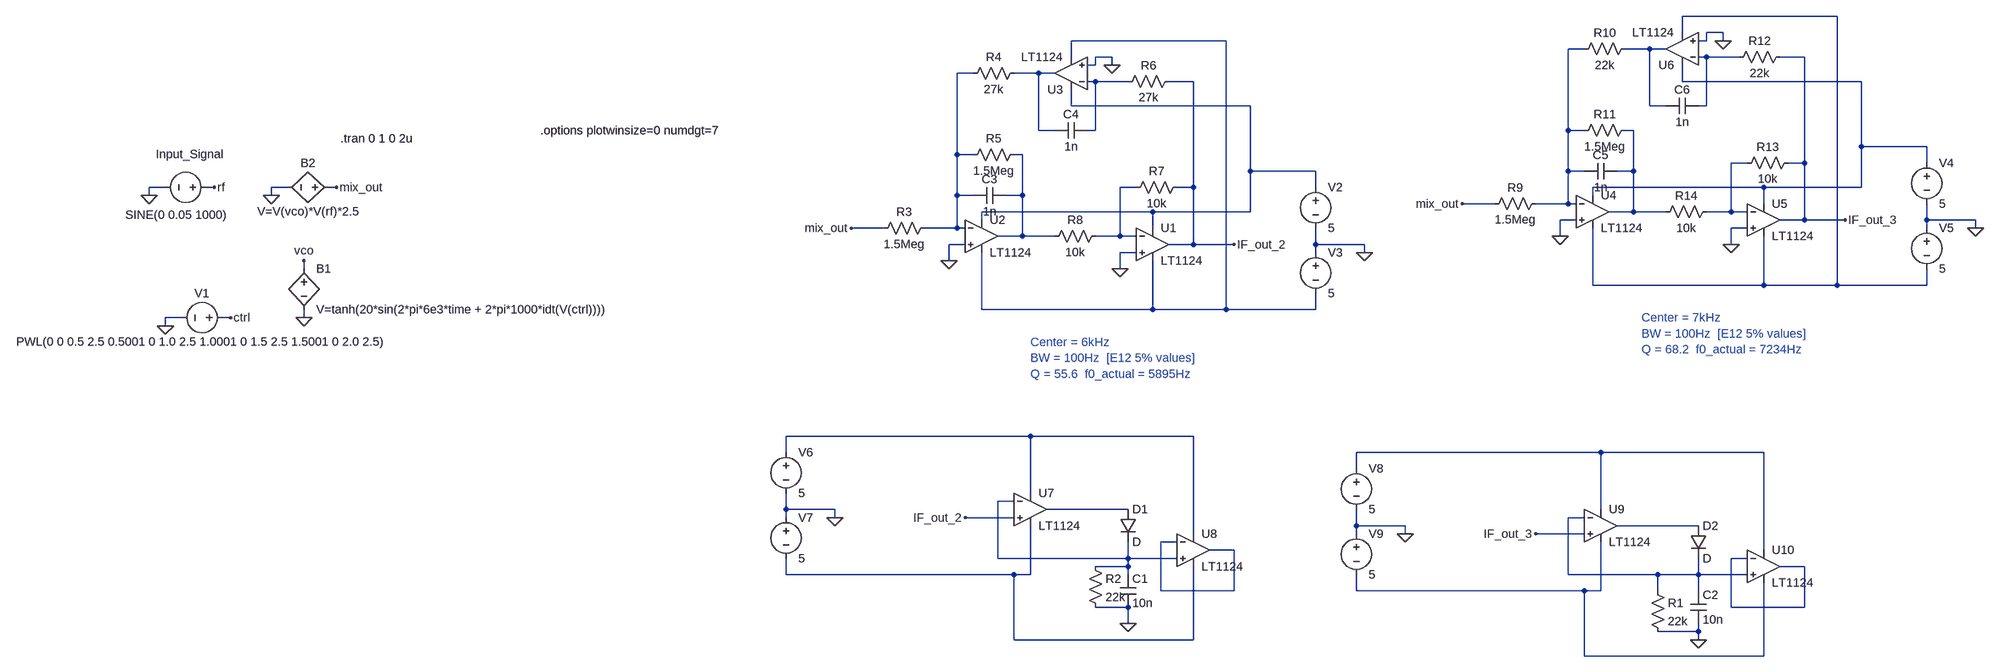
[diagram p0: schematic 5filter_square_pulse.asc]
5filter_square_pulse.asc, the LTspice schematic file:
Version 4.1
SHEET 1 4280 1204
WIRE 3632 -160 3328 -160
WIRE 3328 -128 3328 -160
WIRE 3408 -128 3376 -128
WIRE 2432 -112 2128 -112
WIRE 3376 -112 3376 -128
WIRE 3376 -112 3360 -112
WIRE 3408 -112 3408 -128
WIRE 3136 -96 3104 -96
WIRE 3264 -96 3216 -96
WIRE 3296 -96 3264 -96
WIRE 2128 -80 2128 -112
WIRE 2208 -80 2176 -80
WIRE 3376 -80 3360 -80
WIRE 3440 -80 3376 -80
WIRE 3568 -80 3520 -80
WIRE 2176 -64 2176 -80
WIRE 2176 -64 2160 -64
WIRE 2208 -64 2208 -80
WIRE 1936 -48 1904 -48
WIRE 2064 -48 2016 -48
WIRE 2096 -48 2064 -48
WIRE 2176 -32 2160 -32
WIRE 2240 -32 2176 -32
WIRE 2368 -32 2320 -32
WIRE 3328 -32 3328 -64
WIRE 3680 -32 3328 -32
WIRE 2128 16 2128 -16
WIRE 2480 16 2128 16
WIRE 3264 16 3264 -96
WIRE 3296 16 3264 16
WIRE 3376 16 3376 -80
WIRE 3376 16 3360 16
WIRE 2064 64 2064 -48
WIRE 2096 64 2064 64
WIRE 2176 64 2176 -32
WIRE 2176 64 2160 64
WIRE 3104 64 3104 -96
WIRE 3136 64 3104 64
WIRE 3232 64 3216 64
WIRE 3680 96 3680 -32
WIRE 3808 96 3680 96
WIRE 1904 112 1904 -48
WIRE 1936 112 1904 112
WIRE 2032 112 2016 112
WIRE 3456 128 3424 128
WIRE 3568 128 3568 -80
WIRE 3568 128 3536 128
WIRE 3808 128 3808 96
WIRE 2480 144 2480 16
WIRE 2608 144 2480 144
WIRE 3104 144 3104 64
WIRE 3136 144 3104 144
WIRE 3232 144 3232 64
WIRE 3232 144 3200 144
WIRE 16 176 -16 176
WIRE 112 176 96 176
WIRE 256 176 224 176
WIRE 352 176 336 176
WIRE 2256 176 2224 176
WIRE 2368 176 2368 -32
WIRE 2368 176 2336 176
WIRE 2608 176 2608 144
WIRE 3488 176 3152 176
WIRE 3680 176 3680 96
WIRE 3680 176 3488 176
WIRE -16 192 -16 176
WIRE 224 192 224 176
WIRE 1904 192 1904 112
WIRE 1936 192 1904 192
WIRE 2032 192 2032 112
WIRE 2032 192 2000 192
WIRE 3152 192 3152 176
WIRE 2960 208 2896 208
WIRE 3104 208 3104 144
WIRE 3104 208 3040 208
WIRE 3120 208 3104 208
WIRE 3488 208 3488 176
WIRE 2288 224 1952 224
WIRE 2480 224 2480 144
WIRE 2480 224 2288 224
WIRE 3232 224 3232 144
WIRE 3232 224 3184 224
WIRE 3296 224 3232 224
WIRE 3424 224 3424 128
WIRE 3424 224 3376 224
WIRE 3456 224 3424 224
WIRE 1952 240 1952 224
WIRE 3120 240 3088 240
WIRE 3568 240 3568 128
WIRE 3568 240 3520 240
WIRE 3648 240 3568 240
WIRE 3808 240 3808 208
WIRE 3904 240 3808 240
WIRE 1760 256 1696 256
WIRE 1904 256 1904 192
WIRE 1904 256 1840 256
WIRE 1920 256 1904 256
WIRE 2288 256 2288 224
WIRE 3456 256 3424 256
WIRE 3808 256 3808 240
WIRE 3904 256 3904 240
WIRE 2032 272 2032 192
WIRE 2032 272 1984 272
WIRE 2096 272 2032 272
WIRE 2224 272 2224 176
WIRE 2224 272 2176 272
WIRE 2256 272 2224 272
WIRE 3088 272 3088 240
WIRE 1920 288 1888 288
WIRE 2368 288 2368 176
WIRE 2368 288 2320 288
WIRE 2448 288 2368 288
WIRE 2608 288 2608 256
WIRE 2704 288 2608 288
WIRE 3424 288 3424 256
WIRE 2256 304 2224 304
WIRE 2608 304 2608 288
WIRE 2704 304 2704 288
WIRE 1888 320 1888 288
WIRE 288 336 288 320
WIRE 2224 336 2224 304
WIRE 3152 368 3152 256
WIRE 3488 368 3488 272
WIRE 3488 368 3152 368
WIRE 3632 368 3632 -160
WIRE 3632 368 3488 368
WIRE 3808 368 3808 336
WIRE 3808 368 3632 368
WIRE 1952 416 1952 304
WIRE 2288 416 2288 320
WIRE 2288 416 1952 416
WIRE 2432 416 2432 -112
WIRE 2432 416 2288 416
WIRE 2608 416 2608 384
WIRE 2608 416 2432 416
WIRE 48 432 16 432
WIRE 144 432 128 432
WIRE 288 432 288 416
WIRE 16 448 16 432
WIRE 2048 768 1568 768
WIRE 2368 768 2048 768
WIRE 1568 800 1568 768
WIRE 3168 800 2688 800
WIRE 3488 800 3168 800
WIRE 2688 832 2688 800
WIRE 2048 880 2048 768
WIRE 2016 896 1984 896
WIRE 1568 912 1568 880
WIRE 1664 912 1568 912
WIRE 2240 912 2080 912
WIRE 3168 912 3168 800
WIRE 1568 928 1568 912
WIRE 1664 928 1664 912
WIRE 2016 928 1920 928
WIRE 3136 928 3104 928
WIRE 2688 944 2688 912
WIRE 2784 944 2688 944
WIRE 3360 944 3200 944
WIRE 2368 960 2368 768
WIRE 2688 960 2688 944
WIRE 2784 960 2784 944
WIRE 3136 960 3040 960
WIRE 2336 976 2304 976
WIRE 2448 992 2400 992
WIRE 3488 992 3488 800
WIRE 1984 1008 1984 896
WIRE 2240 1008 2240 976
WIRE 2240 1008 1984 1008
WIRE 2336 1008 2240 1008
WIRE 3456 1008 3424 1008
WIRE 2240 1024 2240 1008
WIRE 2240 1024 2176 1024
WIRE 3568 1024 3520 1024
WIRE 1568 1040 1568 1008
WIRE 2016 1040 1568 1040
WIRE 2048 1040 2048 944
WIRE 2048 1040 2016 1040
WIRE 2240 1040 2240 1024
WIRE 3104 1040 3104 928
WIRE 3280 1040 3104 1040
WIRE 3360 1040 3360 1008
WIRE 3360 1040 3280 1040
WIRE 3456 1040 3360 1040
WIRE 2304 1072 2304 976
WIRE 2448 1072 2448 992
WIRE 2448 1072 2304 1072
WIRE 2688 1072 2688 1040
WIRE 3136 1072 2688 1072
WIRE 3168 1072 3168 976
WIRE 3168 1072 3136 1072
WIRE 3280 1072 3280 1040
WIRE 3360 1072 3360 1040
WIRE 2240 1104 2176 1104
WIRE 3424 1104 3424 1008
WIRE 3568 1104 3568 1024
WIRE 3568 1104 3424 1104
WIRE 2240 1136 2240 1104
WIRE 3360 1152 3360 1136
WIRE 3360 1152 3280 1152
WIRE 2016 1168 2016 1040
WIRE 2368 1168 2368 1024
WIRE 2368 1168 2016 1168
WIRE 3360 1168 3360 1152
WIRE 3136 1200 3136 1072
WIRE 3488 1200 3488 1056
WIRE 3488 1200 3136 1200
FLAG 144 432 ctrl
FLAG 288 320 vco
FLAG 112 176 rf
FLAG 352 176 mix_out
FLAG 16 448 0
FLAG -16 192 0
FLAG 224 192 0
FLAG 288 432 0
FLAG 2208 -64 0
FLAG 2224 336 0
FLAG 1888 320 0
FLAG 2704 304 0
FLAG 1696 256 mix_out
FLAG 2448 288 IF_out_2
FLAG 3408 -112 0
FLAG 3424 288 0
FLAG 3088 272 0
FLAG 3904 256 0
FLAG 2896 208 mix_out
FLAG 3648 240 IF_out_3
FLAG 1664 928 0
FLAG 2240 1136 0
FLAG 1920 928 IF_out_2
FLAG 2784 960 0
FLAG 3360 1168 0
FLAG 3040 960 IF_out_3
SYMBOL voltage 112 176 R90
WINDOW 123 0 0 Left 0
WINDOW 39 0 0 Left 0
WINDOW 0 -65 -20 VRight 2
WINDOW 3 54 -26 VRight 2
SYMATTR InstName Input_Signal
SYMATTR Value SINE(0 0.05 1000)
SYMBOL bv 288 320 R0
SYMATTR InstName B1
SYMATTR Value V=tanh(20*sin(2*pi*6e3*time + 2*pi*1000*idt(V(ctrl))))
SYMBOL voltage 144 432 R90
WINDOW 0 -32 56 VBottom 2
WINDOW 3 32 56 VTop 2
WINDOW 123 0 0 Left 0
WINDOW 39 0 0 Left 0
SYMATTR InstName V1
SYMATTR Value PWL(0 0 0.5 2.5 0.5001 0 1.0 2.5 1.0001 0 1.5 2.5 1.5001 0 2.0 2.5)
SYMBOL bv 352 176 R90
WINDOW 0 -32 56 VBottom 2
WINDOW 3 32 56 VTop 2
SYMATTR InstName B2
SYMATTR Value V=V(vco)*V(rf)*2.5
SYMBOL OpAmps\\LT1124 1952 208 R0
SYMATTR InstName U2
SYMBOL OpAmps\\LT1124 2288 224 R0
SYMATTR InstName U1
SYMBOL OpAmps\\LT1124 2128 16 R180
SYMATTR InstName U3
SYMBOL res 1856 240 R90
WINDOW 0 0 56 VBottom 2
WINDOW 3 32 56 VTop 2
SYMATTR InstName R3
SYMATTR Value 1.5Meg
SYMATTR SpiceLine tol=1
SYMBOL res 2032 -64 R90
WINDOW 0 0 56 VBottom 2
WINDOW 3 32 56 VTop 2
SYMATTR InstName R4
SYMATTR Value 27k
SYMATTR SpiceLine tol=1
SYMBOL res 2032 96 R90
WINDOW 0 0 56 VBottom 2
WINDOW 3 32 56 VTop 2
SYMATTR InstName R5
SYMATTR Value 1.5Meg
SYMATTR SpiceLine tol=1
SYMBOL res 2336 -48 R90
WINDOW 0 0 56 VBottom 2
WINDOW 3 32 56 VTop 2
SYMATTR InstName R6
SYMATTR Value 27k
SYMATTR SpiceLine tol=1
SYMBOL res 2352 160 R90
WINDOW 0 0 56 VBottom 2
WINDOW 3 32 56 VTop 2
SYMATTR InstName R7
SYMATTR Value 10k
SYMATTR SpiceLine tol=1
SYMBOL res 2192 256 R90
WINDOW 0 0 56 VBottom 2
WINDOW 3 32 56 VTop 2
SYMATTR InstName R8
SYMATTR Value 10k
SYMATTR SpiceLine tol=1
SYMBOL cap 2000 176 R90
WINDOW 0 0 32 VBottom 2
WINDOW 3 32 32 VTop 2
SYMATTR InstName C3
SYMATTR Value 1n
SYMBOL cap 2160 48 R90
WINDOW 0 0 32 VBottom 2
WINDOW 3 32 32 VTop 2
SYMATTR InstName C4
SYMATTR Value 1n
SYMBOL voltage 2608 160 R0
WINDOW 123 0 0 Left 0
WINDOW 39 0 0 Left 0
SYMATTR InstName V2
SYMATTR Value 5
SYMBOL voltage 2608 288 R0
WINDOW 123 0 0 Left 0
WINDOW 39 0 0 Left 0
SYMATTR InstName V3
SYMATTR Value 5
SYMBOL OpAmps\\LT1124 3152 160 R0
SYMATTR InstName U4
SYMBOL OpAmps\\LT1124 3488 176 R0
SYMATTR InstName U5
SYMBOL OpAmps\\LT1124 3328 -32 R180
SYMATTR InstName U6
SYMBOL res 3056 192 R90
WINDOW 0 0 56 VBottom 2
WINDOW 3 32 56 VTop 2
SYMATTR InstName R9
SYMATTR Value 1.5Meg
SYMATTR SpiceLine tol=1
SYMBOL res 3232 -112 R90
WINDOW 0 0 56 VBottom 2
WINDOW 3 32 56 VTop 2
SYMATTR InstName R10
SYMATTR Value 22k
SYMATTR SpiceLine tol=1
SYMBOL res 3232 48 R90
WINDOW 0 0 56 VBottom 2
WINDOW 3 32 56 VTop 2
SYMATTR InstName R11
SYMATTR Value 1.5Meg
SYMATTR SpiceLine tol=1
SYMBOL res 3536 -96 R90
WINDOW 0 0 56 VBottom 2
WINDOW 3 32 56 VTop 2
SYMATTR InstName R12
SYMATTR Value 22k
SYMATTR SpiceLine tol=0.1
SYMBOL res 3552 112 R90
WINDOW 0 0 56 VBottom 2
WINDOW 3 32 56 VTop 2
SYMATTR InstName R13
SYMATTR Value 10k
SYMATTR SpiceLine tol=1
SYMBOL res 3392 208 R90
WINDOW 0 0 56 VBottom 2
WINDOW 3 32 56 VTop 2
SYMATTR InstName R14
SYMATTR Value 10k
SYMATTR SpiceLine tol=1
SYMBOL cap 3200 128 R90
WINDOW 0 0 32 VBottom 2
WINDOW 3 32 32 VTop 2
SYMATTR InstName C5
SYMATTR Value 1n
SYMBOL cap 3360 0 R90
WINDOW 0 0 32 VBottom 2
WINDOW 3 32 32 VTop 2
SYMATTR InstName C6
SYMATTR Value 1n
SYMBOL voltage 3808 112 R0
WINDOW 123 0 0 Left 0
WINDOW 39 0 0 Left 0
SYMATTR InstName V4
SYMATTR Value 5
SYMBOL voltage 3808 240 R0
WINDOW 123 0 0 Left 0
WINDOW 39 0 0 Left 0
SYMATTR InstName V5
SYMATTR Value 5
SYMBOL OpAmps\\LT1124 2048 848 R0
SYMATTR InstName U7
SYMBOL voltage 1568 784 R0
WINDOW 123 0 0 Left 0
WINDOW 39 0 0 Left 0
SYMATTR InstName V6
SYMATTR Value 5
SYMBOL voltage 1568 912 R0
WINDOW 123 0 0 Left 0
WINDOW 39 0 0 Left 0
SYMATTR InstName V7
SYMATTR Value 5
SYMBOL diode 2224 912 R0
SYMATTR InstName D1
SYMBOL cap 2224 1040 R0
SYMATTR InstName C1
SYMATTR Value 10n
SYMBOL OpAmps\\LT1124 2368 928 R0
SYMATTR InstName U8
SYMBOL OpAmps\\LT1124 3168 880 R0
SYMATTR InstName U9
SYMBOL voltage 2688 816 R0
WINDOW 123 0 0 Left 0
WINDOW 39 0 0 Left 0
SYMATTR InstName V8
SYMATTR Value 5
SYMBOL voltage 2688 944 R0
WINDOW 123 0 0 Left 0
WINDOW 39 0 0 Left 0
SYMATTR InstName V9
SYMATTR Value 5
SYMBOL diode 3344 944 R0
SYMATTR InstName D2
SYMBOL cap 3344 1072 R0
SYMATTR InstName C2
SYMATTR Value 10n
SYMBOL OpAmps\\LT1124 3488 960 R0
SYMATTR InstName U10
SYMBOL res 3264 1056 R0
SYMATTR InstName R1
SYMATTR Value 22k
SYMBOL res 2160 1008 R0
SYMATTR InstName R2
SYMATTR Value 22k
TEXT 360 80 Left 2 !.tran 0 1 0 2u
TEXT 752 64 Left 2 !.options plotwinsize=0 numdgt=7
TEXT 2048 480 Left 2 ;Center = 6kHz\nBW = 100Hz  [E12 5% values]\nQ = 55.6  f0_actual = 5895Hz
TEXT 3248 432 Left 2 ;Center = 7kHz\nBW = 100Hz  [E12 5% values]\nQ = 68.2  f0_actual = 7234Hz

The netlist it stands for:
* 5filter_square_pulse.asc
V§Input_Signal rf 0 SINE(0 0.05 1000)
B1 vco 0 V=tanh(20*sin(2*pi*6e3*time + 2*pi*1000*idt(V(ctrl))))
V1 ctrl 0 PWL(0 0 0.5 2.5 0.5001 0 1.0 2.5 1.0001 0 1.5 2.5 1.5001 0 2.0 2.5)
B2 mix_out 0 V=V(vco)*V(rf)*2.5
X§U2 0 N006 N010 N002 N012 LT1124  ; pins In+ In- V+ V- OUT
X§U1 0 N014 N010 N002 IF_out_2 LT1124  ; pins In+ In- V+ V- OUT
X§U3 0 N008 N010 N002 N007 LT1124  ; pins In+ In- V+ V- OUT
R3 N006 mix_out 1.5Meg tol=1
R4 N007 N006 27k tol=1
R5 N012 N006 1.5Meg tol=1
R6 IF_out_2 N008 27k tol=1
R7 IF_out_2 N014 10k tol=1
R8 N014 N012 10k tol=1
C3 N012 N006 1n
C4 N008 N007 1n
V2 N010 0 5
V3 0 N002 5
X§U4 0 N003 N009 N001 N011 LT1124  ; pins In+ In- V+ V- OUT
X§U5 0 N013 N009 N001 IF_out_3 LT1124  ; pins In+ In- V+ V- OUT
X§U6 0 N005 N009 N001 N004 LT1124  ; pins In+ In- V+ V- OUT
R9 N003 mix_out 1.5Meg tol=1
R10 N004 N003 22k tol=1
R11 N011 N003 1.5Meg tol=1
R12 IF_out_3 N005 22k tol=0.1
R13 IF_out_3 N013 10k tol=1
R14 N013 N011 10k tol=1
C5 N011 N003 1n
C6 N005 N004 1n
V4 N009 0 5
V5 0 N001 5
X§U7 IF_out_2 N017 N015 N023 N018 LT1124  ; pins In+ In- V+ V- OUT
V6 N015 0 5
V7 0 N023 5
D1 N018 N017 D
C1 N017 0 10n
X§U8 N017 N021 N015 N023 N021 LT1124  ; pins In+ In- V+ V- OUT
X§U9 IF_out_3 N019 N016 N024 N020 LT1124  ; pins In+ In- V+ V- OUT
V8 N016 0 5
V9 0 N024 5
D2 N020 N019 D
C2 N019 0 10n
X§U10 N019 N022 N016 N024 N022 LT1124  ; pins In+ In- V+ V- OUT
R1 N019 0 22k
R2 N017 0 22k
.model D D
.lib standard.dio
.tran 0 1 0 2u
.options plotwinsize=0 numdgt=7
* Center = 6kHz
* BW = 100Hz  [E12 5% values]
* Q = 55.6  f0_actual = 5895Hz
* Center = 7kHz
* BW = 100Hz  [E12 5% values]
* Q = 68.2  f0_actual = 7234Hz
.lib LTC.lib
.backanno
.end